# EAGLE board bontor_mbed_rev_c (EAGLE 6.3), part 1 of 2
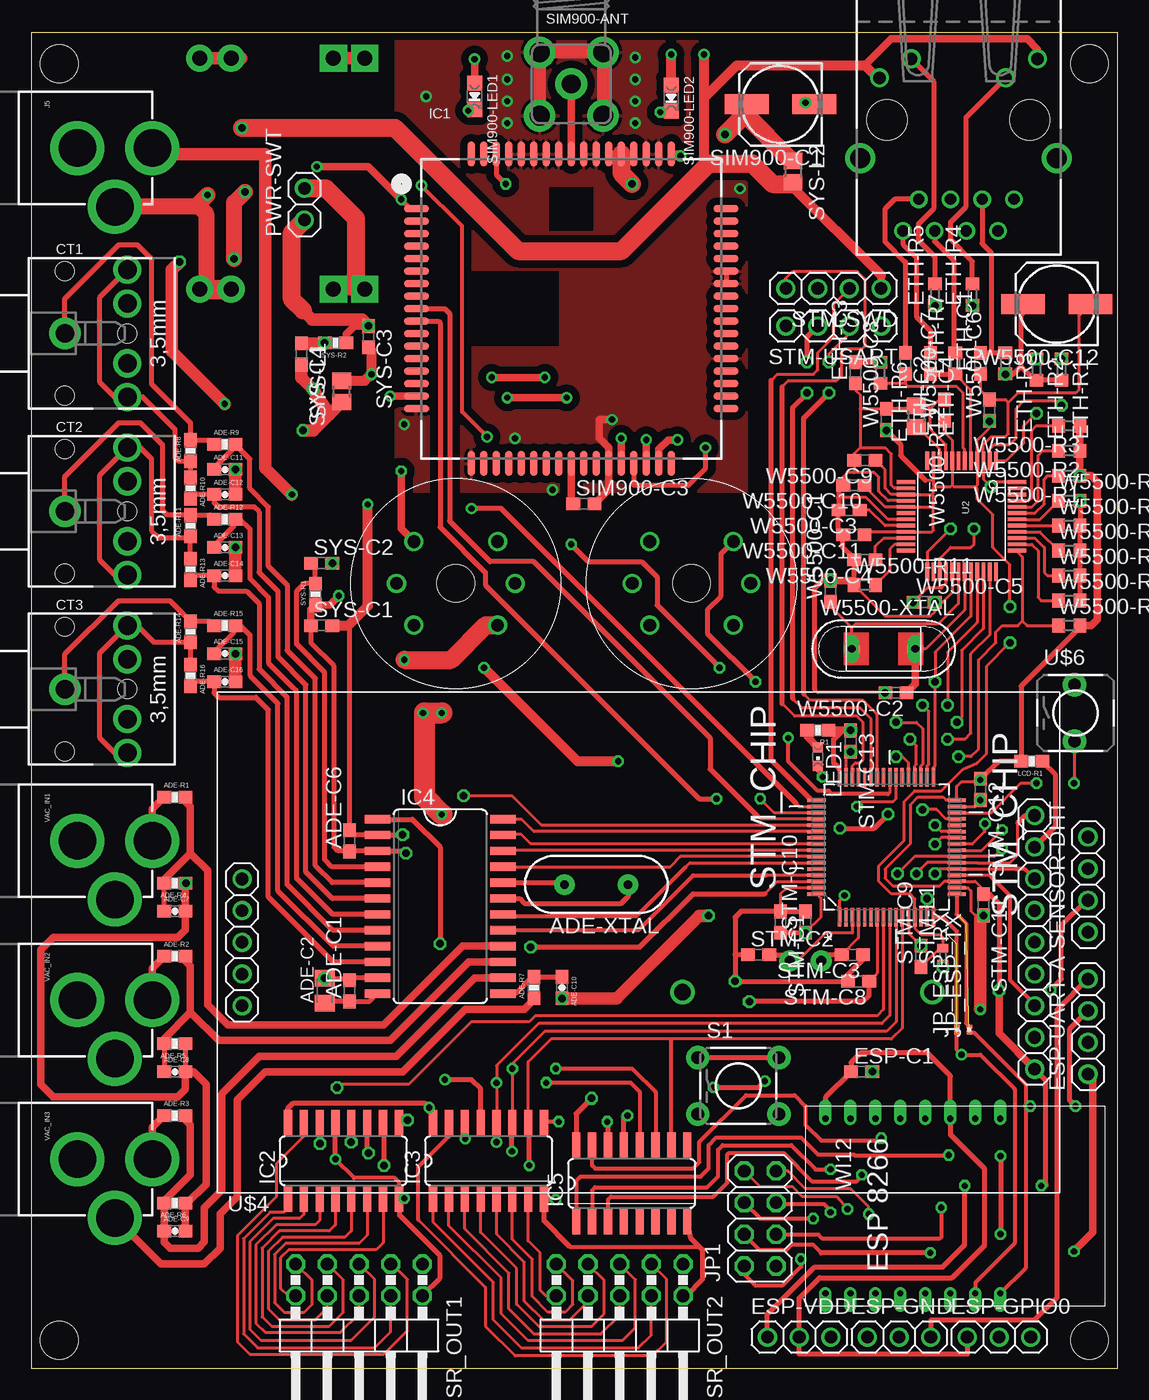
[diagram p2: board, top side]
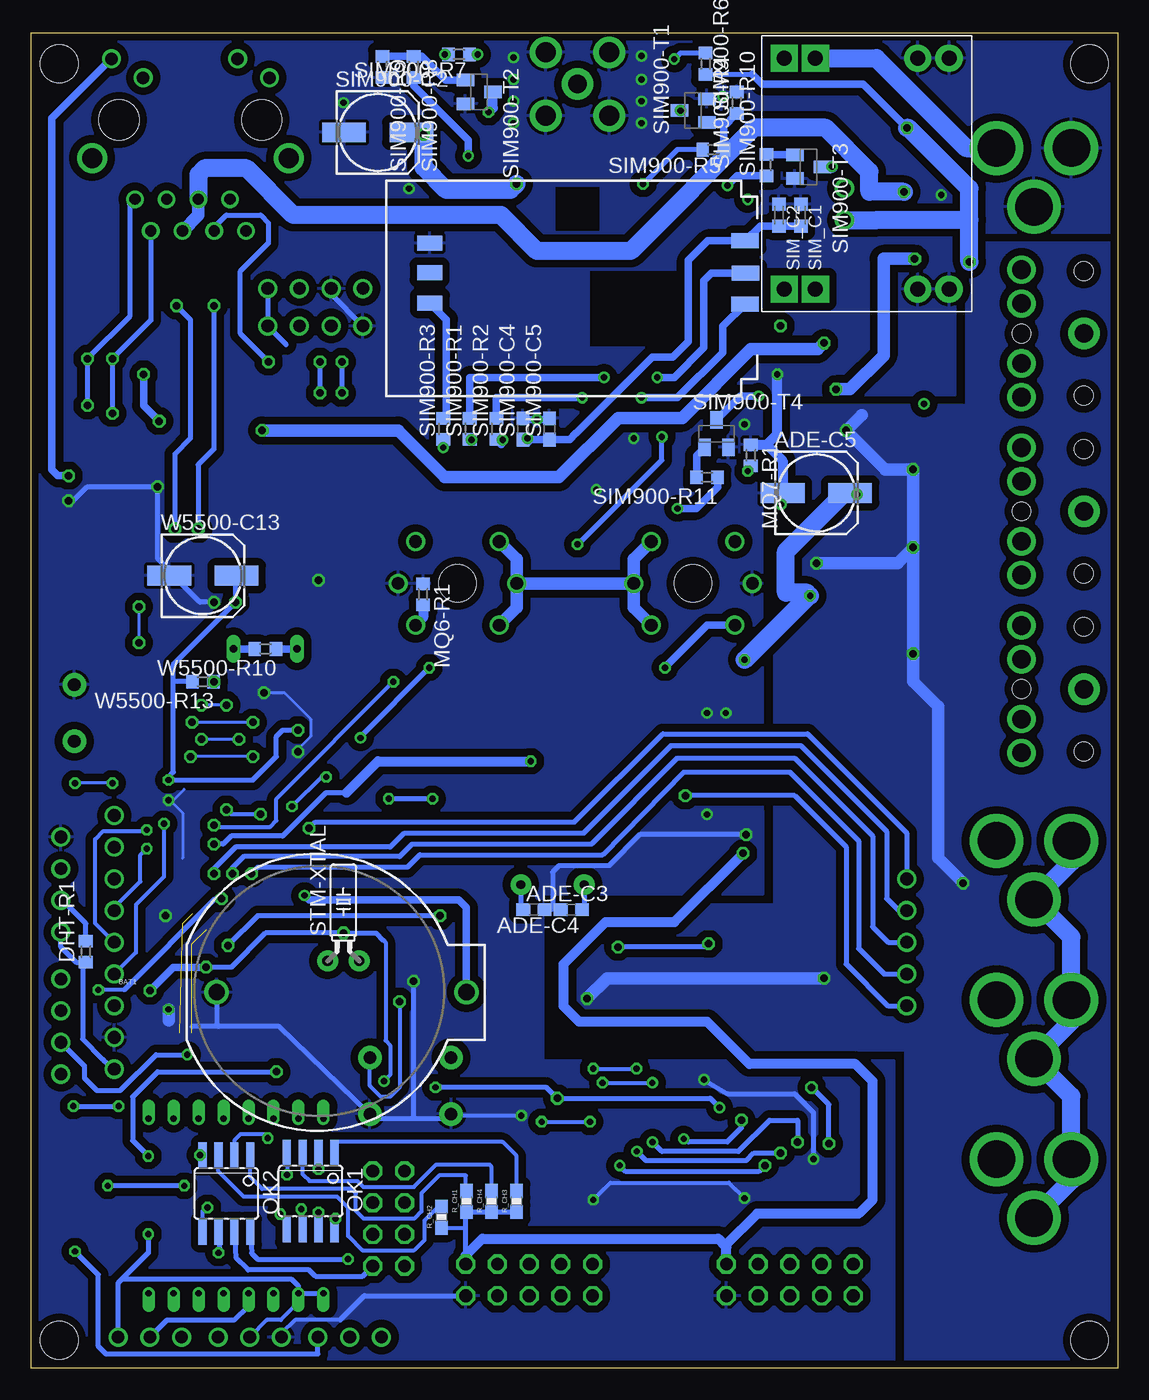
[diagram p3: board, bottom side, seen from below]

Size 87 x 107 mm. Coordinates in mm from the lower left corner, seen from the top.
Outline: 87,0 87,107 0,107 0,0 87,0
Copper layers (1*16): Top 0.035mm / dielectric 1.5mm / Bottom 0.035mm
Design rules "default *": minimum track width 10mil, minimum drill 10mil, track to track 0.125mm, track to pad 0.125mm, pad to pad 0.125mm, via to via 0.125mm, smd to smd 0mil, copper to edge 0.5mm, drill to drill 0.2mm, minimum pad ring 10mil, minimum via ring 8mil, stop-mask expansion 4mil, vias tented up to drill 0mil, thermal gap 10mil
Net classes: 1 power: width 0.305 mm, drill 0.6 mm, clearance 0.254 mm; 2 gnd: width 0.254 mm, drill 0.6 mm, clearance 0.254 mm
Holes 3 mm at 2.25,2.25 84.75,2.25 2.25,104.5 84.75,104.5

## Footprints (pad centres in the part's own frame; a part is rotated, then mirrored left to right if it is on the bottom)
C0603 = smd 1.1 x 1: 1 -0.85,0; 2 0.85,0
C0805K = smd 1.3 x 1.6: 1 -1,0; 2 1,0
153CLV-0605 = smd 3.5 x 1.6: + 2.7,0; - -2.7,0
0603-CAP = smd 1.1 x 1: 1 -0.85,0; 2 0.85,0
0603-RES = smd 1.1 x 1: 1 -0.85,0; 2 0.85,0
HC49US = drill 0.7 pad 1.651: 1 -2.54,0; 2 2.54,0
BATTCOM_20MM_PTH = drill 1.3: 1 11.85,0; 2 -8.15,0
STX3100 = drill 1.5 pad 2.54: 1 2.7,-0.1 | drill 1.5: 2 7.7,5; 3 7.7,2.3; 4 7.7,-2.5; 5 7.7,-5.2 | hole 1.5: 2.7,4.9; 2.7,-5.1; 7.7,-0.1
DCDCMODULE-SMALL = drill 1.2 pad 2.184: INM#1 1.8,15; INM#2 1.8,12.5; OUTM#1 20.3,15; OUTM#2 20.3,12.5 | drill 1.2 pad 2.184 square: INP#1 1.8,4.3; INP#2 1.8,1.8; OUTP#1 20.3,4.3; OUTP#2 20.3,1.8
R0603 = smd 1 x 1.1: 1 -0.85,0; 2 0.85,0
1X03 = drill 1.016: 1 -2.54,0; 2 0,0; 3 2.54,0
PINHD4 = drill 1.016: 1 -3.81,0; 2 -1.27,0; 3 1.27,0; 4 3.81,0
RJ45_PULSEJACK = drill 0.9: 1 4.445,-6.35; 2 3.175,-8.89; 3 1.905,-6.35; 4 0.635,-8.89; 5 -0.635,-6.35; 6 -1.905,-8.89; 7 -3.175,-6.35; 8 -4.445,-8.89 | drill 1: 9 6.325,4.9; 10 3.785,3.38; 11 -3.785,4.9; 12 -6.325,3.38 | drill 1.6: P$5 -7.875,-3.05; P$6 7.875,-3.05 | hole 3.2: -5.715,0; 5.715,0
SIM900_SMT = smd 2 x 0.6: P$1 -12.4,8; P$2 -12.4,7; P$3 -12.4,6; P$4 -12.4,5; P$5 -12.4,4; P$6 -12.4,3; P$7 -12.4,2; P$8 -12.4,1; P$9 -12.4,0; P$10 -12.4,-1; P$11 -12.4,-2; P$12 -12.4,-3; P$13 -12.4,-4; P$14 -12.4,-5; P$15 -12.4,-6; P$16 -12.4,-7; P$17 -12.4,-8; P$35 12.4,-8; P$36 12.4,-7; P$37 12.4,-6; P$38 12.4,-5; P$39 12.4,-4; P$40 12.4,-3; P$41 12.4,-2; P$42 12.4,-1; P$43 12.4,0; P$44 12.4,1; P$45 12.4,2; P$46 12.4,3; P$47 12.4,4; P$48 12.4,5; P$49 12.4,6; P$50 12.4,7; P$51 12.4,8 | smd 0.6 x 2: P$18 -8,-12.4; P$19 -7,-12.4; P$20 -6,-12.4; P$21 -5,-12.4; P$22 -4,-12.4; P$23 -3,-12.4; P$24 -2,-12.4; P$25 -1,-12.4; P$26 0,-12.4; P$27 1,-12.4; P$28 2,-12.4; P$29 3,-12.4; P$30 4,-12.4; P$31 5,-12.4; P$32 6,-12.4; P$33 7,-12.4; P$34 8,-12.4; P$52 8,12.4; P$53 7,12.4; P$54 6,12.4; P$55 5,12.4; P$56 4,12.4; P$57 3,12.4; P$58 2,12.4; P$59 1,12.4; P$60 0,12.4; P$61 -1,12.4; P$62 -2,12.4; P$63 -3,12.4; P$64 -4,12.4; P$65 -5,12.4; P$66 -6,12.4; P$67 -7,12.4; P$68 -8,12.4
SO16 = smd 0.66 x 2.032: 1 -4.445,-3.073; 2 -3.175,-3.073; 3 -1.905,-3.073; 4 -0.635,-3.073; 5 0.635,-3.073; 6 1.905,-3.073; 7 3.175,-3.073; 8 4.445,-3.073; 9 4.445,3.073; 10 3.175,3.073; 11 1.905,3.073; 12 0.635,3.073; 13 -0.635,3.073; 14 -1.905,3.073; 15 -3.175,3.073; 16 -4.445,3.073
SOIC24 = smd 0.66 x 2.032: 1 -6.985,-5.029; 2 -5.715,-5.029; 3 -4.445,-5.029; 4 -3.175,-5.029; 5 -1.905,-5.029; 6 -0.635,-5.029; 7 0.635,-5.029; 8 1.905,-5.029; 9 3.175,-5.029; 10 4.445,-5.029; 11 5.715,-5.029; 12 6.985,-5.029; 13 6.985,5.029; 14 5.715,5.029; 15 4.445,5.029; 16 3.175,5.029; 17 1.905,5.029; 18 0.635,5.029; 19 -0.635,5.029; 20 -1.905,5.029; 21 -3.175,5.029; 22 -4.445,5.029; 23 -5.715,5.029; 24 -6.985,5.029
POWER_JACK_PTH = drill 2.997 pad 4.318: GND 0,7.7; GNDBREAK 4.7,10.7; PWR 0,13.7
2X04 = drill 1.016 octagon: 1 -3.81,-1.27; 2 -3.81,1.27; 3 -1.27,-1.27; 4 -1.27,1.27; 5 1.27,-1.27; 6 1.27,1.27; 7 3.81,-1.27; 8 3.81,1.27
R0201 = smd 0.28 x 0.43: 1 -0.255,0; 2 0.255,0
CHIPLED_0603 = smd 0.8 x 0.8: A 0,-0.75; C 0,0.75
SOIC08 = smd 0.66 x 2.032: 1 -1.905,-3.073; 2 -0.635,-3.073; 3 0.635,-3.073; 4 1.905,-3.073; 5 1.905,3.073; 6 0.635,3.073; 7 -0.635,3.073; 8 -1.905,3.073
PINHD2 = drill 1.016: 1 -1.27,0; 2 1.27,0
TACTILE-PTH = drill 1.016 pad 1.88: 1 -3.251,2.261; 2 3.251,2.261; 3 -3.251,-2.261; 4 3.251,-2.261
MQ-3 = drill 1.016: A1 -3.35,3.35; A2 -3.35,-3.35; B1 3.35,3.35; B2 3.35,-3.35; HA -4.75,0; HB 4.75,0 | hole 3: 0,0
SMA90_DIP = drill 1.5 pad 2.54: ANTENNA 0,0 | drill 1.6 pad 2.54: GND1 -2.54,2.54; GND2 2.54,2.54; GND3 -2.54,-2.54; GND4 2.54,-2.54
CHIPLED_0805_NOOUTLINE = smd 1.2 x 1.2: A 0,-1.05; C 0,1.05
SOT23-BEC = smd 1 x 1.4: B -0.95,-1.1; C 0,1.1; E 0.95,-1.1
C0603K = smd 1.05 x 1.08: 1 -0.875,0; 2 0.875,0
SIMHOLDER3 = smd 2.2 x 1.2: 1 0.95,4.81; 2 0.91,7.41; 3 0.95,9.86 | smd 2 x 1.2: 4 26.2,9.78; 5 26.22,7.34; 6 26.22,4.98
2X05/90 = drill 1.016 octagon: 1 -5.08,-6.35; 2 -5.08,-3.81; 3 -2.54,-6.35; 4 -2.54,-3.81; 5 0,-6.35; 6 0,-3.81; 7 2.54,-6.35; 8 2.54,-3.81; 9 5.08,-6.35; 10 5.08,-3.81
0402 = smd 0.7 x 0.9: 1 -0.65,0; 2 0.65,0
TC26H = drill 0.813 pad 1.676: 1 -1.27,0; 2 1.27,0
QFP50P1200X1200X160-64N = smd 1.473 x 0.279: 1 -5.613,3.759; 2 -5.613,3.251; 3 -5.613,2.743; 4 -5.613,2.261; 5 -5.613,1.753; 6 -5.613,1.245; 7 -5.613,0.762; 8 -5.613,0.254; 9 -5.613,-0.254; 10 -5.613,-0.762; 11 -5.613,-1.245; 12 -5.613,-1.753; 13 -5.613,-2.261; 14 -5.613,-2.743; 15 -5.613,-3.251; 16 -5.613,-3.759; 33 5.613,-3.759; 34 5.613,-3.251; 35 5.613,-2.743; 36 5.613,-2.261; 37 5.613,-1.753; 38 5.613,-1.245; 39 5.613,-0.762; 40 5.613,-0.254; 41 5.613,0.254; 42 5.613,0.762; 43 5.613,1.245; 44 5.613,1.753; 45 5.613,2.261; 46 5.613,2.743; 47 5.613,3.251; 48 5.613,3.759 | smd 0.279 x 1.473: 17 -3.759,-5.613; 18 -3.251,-5.613; 19 -2.743,-5.613; 20 -2.261,-5.613; 21 -1.753,-5.613; 22 -1.245,-5.613; 23 -0.762,-5.613; 24 -0.254,-5.613; 25 0.254,-5.613; 26 0.762,-5.613; 27 1.245,-5.613; 28 1.753,-5.613; 29 2.261,-5.613; 30 2.743,-5.613; 31 3.251,-5.613; 32 3.759,-5.613; 49 3.759,5.613; 50 3.251,5.613; 51 2.743,5.613; 52 2.261,5.613; 53 1.753,5.613; 54 1.245,5.613; 55 0.762,5.613; 56 0.254,5.613; 57 -0.254,5.613; 58 -0.762,5.613; 59 -1.245,5.613; 60 -1.753,5.613; 61 -2.261,5.613; 62 -2.743,5.613; 63 -3.251,5.613; 64 -3.759,5.613
FB805 = smd 1.3 x 1.5: 1 -0.85,0; 2 0.85,0
W5500 = smd 1.5 x 0.3: 1 -4.45,2.75; 2 -4.45,2.25; 3 -4.45,1.75; 4 -4.45,1.25; 5 -4.45,0.75; 6 -4.45,0.25; 7 -4.45,-0.25; 8 -4.45,-0.75; 9 -4.45,-1.25; 10 -4.45,-1.75; 11 -4.45,-2.25; 12 -4.45,-2.75; 25 4.45,-2.75; 26 4.45,-2.25; 27 4.45,-1.75; 28 4.45,-1.25; 29 4.45,-0.75; 30 4.45,-0.25; 31 4.45,0.25; 32 4.45,0.75; 33 4.45,1.25; 34 4.45,1.75; 35 4.45,2.25; 36 4.45,2.75 | smd 0.3 x 1.5: 13 -2.75,-4.45; 14 -2.25,-4.45; 15 -1.75,-4.45; 16 -1.25,-4.45; 17 -0.75,-4.45; 18 -0.25,-4.45; 19 0.25,-4.45; 20 0.75,-4.45; 21 1.25,-4.45; 22 1.75,-4.45; 23 2.25,-4.45; 24 2.75,-4.45; 37 2.75,4.45; 38 2.25,4.45; 39 1.75,4.45; 40 1.25,4.45; 41 0.75,4.45; 42 0.25,4.45; 43 -0.25,4.45; 44 -0.75,4.45; 45 -1.25,4.45; 46 -1.75,4.45; 47 -2.25,4.45; 48 -2.75,4.45
CRISTAL-ABM7 = smd 1.27 x 0.635: P$1 -2.54,0; P$2 2.54,0
TFT_LCD_2.2+F_CS = drill 1.016: F_CS -31.86,5.08; LCD_CS 31.6,-5.08; LCD_D/C 31.6,0; LCD_GND 31.6,-7.62; LCD_LED 31.6,7.62; LCD_MISO 31.6,10.16; LCD_MOSI 31.6,2.54; LCD_RESET 31.6,-2.54; LCD_SCK 31.6,5.08; LCD_VCC 31.6,-10.16; SD_CS -31.86,-5.08; SD_MISO -31.86,0; SD_MOSI -31.86,-2.54; SD_SCK -31.86,2.54
WI12 = drill 0.5 pad 0.813 offset: ADC 10.4,1; CH_PD 12.4,1; GND 22.4,15; GPIO00 16.4,15; GPIO02 18.4,15; GPIO04 12.4,15; GPIO05 14.4,15; GPIO12 18.4,1; GPIO13 20.4,1; GPIO14 16.4,1; GPIO15 20.4,15; GPIO16 14.4,1; REST 8.4,1; RXD 10.4,15; TXD 8.4,15; VCC 22.4,1
TACTILE-PTH-SINGLE = drill 1.016 pad 1.88: 1 -0.076,2.261; 3 -0.076,-2.261
R0805 = smd 1.3 x 1.5: 1 -0.85,0; 2 0.85,0
QS = drill 0.61 long: 1 -2.54,0; 2 2.54,0

## Placement (x,y rotation side)
ADE-C1  0.1uF  [C0603]  25.5,30.25 90 top
ADE-C2  10uF  [C0805K]  23.5,30.25 90 top
ADE-C3  22pF  [C0603]  46.75,36.75 0 bottom
ADE-C4  22pF  [C0603]  43.75,36.75 180 bottom
ADE-C5  10uF  [153CLV-0605]  24.12,70.12 0 bottom
ADE-C6  100nF  [C0603]  25.5,42.25 90 top
ADE-C7  33nF  [0603-CAP]  11.5,36.62 0 top
ADE-C8  33nF  [0603-CAP]  11.5,23.75 0 top
ADE-C9  33nF  [0603-CAP]  11.5,11 0 top
ADE-C10  33nF  [0603-CAP]  42.5,30.5 270 top
ADE-C11  33nF  [0603-CAP]  15.5,72 0 top
ADE-C12  33nF  [0603-CAP]  15.5,70 0 top
ADE-C13  33nF  [0603-CAP]  15.5,65.75 0 top
ADE-C14  33nF  [0603-CAP]  15.5,63.5 0 top
ADE-C15  33nF  [0603-CAP]  15.5,57.25 0 top
ADE-C16  33nF  [0603-CAP]  15.5,55 0 top
ADE-R1  81K  [0603-RES]  11.5,45.75 0 top
ADE-R2  81K  [0603-RES]  11.5,33 0 top
ADE-R3  81K  [0603-RES]  11.5,20.25 0 top
ADE-R4  1K  [0603-RES]  11.5,38.88 180 top
ADE-R5  1K  [0603-RES]  11.5,26 180 top
ADE-R6  1K  [0603-RES]  11.5,13.25 180 top
ADE-R7  1K  [0603-RES]  40.25,30.5 90 top
ADE-R8  33R  [0603-RES]  12.75,73.5 90 top
ADE-R9  1K  [0603-RES]  15.5,74 0 top
ADE-R10  1K  [0603-RES]  12.75,70.5 270 top
ADE-R11  33R  [0603-RES]  12.75,67.5 90 top
ADE-R12  1K  [0603-RES]  15.5,68 0 top
ADE-R13  1K  [0603-RES]  12.75,64 270 top
ADE-R14  33R  [0603-RES]  12.75,59 90 top
ADE-R15  1K  [0603-RES]  15.5,59.5 0 top
ADE-R16  1K  [0603-RES]  12.75,55.5 270 top
ADE-XTAL  10MHz  [HC49US]  45.25,38.75 180 top
BAT1  [BATTCOM_20MM_PTH]  64,30.12 0 bottom
CT1  100A  [STX3100]  0,83 0 top
CT2  100A  [STX3100]  0,68.75 0 top
CT3  100A  [STX3100]  0,54.5 0 top
DCDC-3.5V  DCDCMODULE_SMALL  [DCDCMODULE-SMALL]  28.5,106.75 270 bottom
DHT-R1  10k  [R0603]  82.62,33.38 90 bottom
ESP-C1  100nF  [C0603]  66.5,23.75 0 top
ESP-GND  [1X03]  69.5,2.5 0 top
ESP-GPIO0  [1X03]  77.5,2.5 0 top
ESP-UART-A  PINHD4  [PINHD4]  84.62,27.38 90 top
ESP-VDD  [1X03]  61.5,2.5 0 top
ETH-C1  22nF  [C0603]  76,80.5 90 top
ETH-C2  6.8nF  [C0603]  70,80.5 270 top
ETH-C3  10nF  [C0603]  66,79.75 90 top
ETH-C4  6.8nF  [C0603]  72,80.5 270 top
ETH-R1  49R9  [R0603]  82.5,80 270 top
ETH-R2  49R9  [R0603]  80.5,80 270 top
ETH-R3  10R  [R0603]  78,80.5 270 top
ETH-R4  330  [R0603]  75.38,86 90 top
ETH-R5  330  [R0603]  72.38,86 90 top
ETH-R6  49R9  [R0603]  68,79.75 270 top
ETH-R7  49R9  [R0603]  74,80.5 90 top
ETHERNET  [RJ45_PULSEJACK]  74.25,100 0 top
IC1  SIM900  [SIM900_SMT]  43.25,84.88 0 top
IC2  74HC595D  [SO16]  25,16.62 0 top
IC3  74HC595D  [SO16]  36.62,16.62 0 top
IC4  ADE7758RW  [SOIC24]  32.75,37 270 top
IC5  74HC595D  [SO16]  48.09,14.81 0 top
J5  POWER_JACKPTH  [POWER_JACK_PTH]  -4,97.75 270 top
JP1  [2X04]  58.38,12 90 top
JP_ESP_RX  0  [R0201]  74.12,27.12 90 top
JP_ESP_TX  0  [R0201]  75.12,27.12 90 top
LCD-R1  680R  [0603-RES]  80.12,48.62 180 top
LED1  [CHIPLED_0603]  63,49 180 top
MQ6-R1  10k  [R0603]  55.62,62 270 bottom
MQ7-R1  10k  [R0603]  29.38,73.12 270 bottom
OK1  ILD205  [SOIC08]  64.62,14.2 180 bottom
OK2  ILD205  [SOIC08]  71.38,14 180 bottom
PWR-SWT  PINHD2  [PINHD2]  21.88,93.25 90 top
R1  [0603-RES]  63,51.12 180 top
R_CH1  270  [0603-RES]  52.12,13.38 90 bottom
R_CH2  270  [0603-RES]  54.14,12.11 90 bottom
R_CH3  270  [0603-RES]  48.12,13.38 90 bottom
R_CH4  270  [0603-RES]  50.12,13.38 90 bottom
S1  [TACTILE-PTH]  56.62,22.62 0 top
SENSOR-DHT  PINHD4  [PINHD4]  84.62,38.75 90 top
SENSOR-MQ6  METHANE_SENSOR  [MQ-3]  52.88,62.88 0 top
SENSOR-MQ7  METHANE_SENSOR  [MQ-3]  34,62.88 180 top
SIM900-ANT  [SMA90_DIP]  43.25,102.88 0 top
SIM900-C1  100uF  [153CLV-0605]  60,101.25 180 top
SIM900-C2  100uF  [153CLV-0605]  59.25,99 0 bottom
SIM900-C3  4u7  [C0603]  44.25,69.25 0 top
SIM900-C4  100nF  [C0603]  47.62,75.25 90 bottom
SIM900-C5  22pF  [C0603]  45.5,75.25 90 bottom
SIM900-LED1  [CHIPLED_0805_NOOUTLINE]  35.5,101.88 180 top
SIM900-LED2  [CHIPLED_0805_NOOUTLINE]  51.25,101.75 180 top
SIM900-R1  22R  [R0603]  51.88,75.25 90 bottom
SIM900-R2  22R  [R0603]  49.75,75.25 90 bottom
SIM900-R3  22R  [R0603]  54,75.25 90 bottom
SIM900-R4  680R  [R0603]  33,104.5 270 bottom
SIM900-R5  1K  [R0603]  32.38,97.62 180 bottom
SIM900-R6  10K  [R0603]  30.5,101.38 90 bottom
SIM900-R7  680R  [R0603]  52.75,105.25 180 bottom
SIM900-R8  1K  [R0603]  56.38,104.25 270 bottom
SIM900-R9  10K  [R0603]  58.88,104.25 270 bottom
SIM900-R10  120R  [R0603]  28.12,96.38 90 bottom
SIM900-R11  120R  [R0603]  32.88,71.38 180 bottom
SIM900-T1  [SOT23-BEC]  34,100.75 90 bottom
SIM900-T2  [SOT23-BEC]  51.12,102.25 270 bottom
SIM900-T3  [SOT23-BEC]  24.75,96.25 270 bottom
SIM900-T4  [SOT23-BEC]  32.12,74.88 0 bottom
SIM_C1  100nF  [C0603K]  25.38,92.38 270 bottom
SIM_C2  22pF  [C0603K]  27.12,92.38 270 bottom
SIM_HOLDER  SIMHOLDER3  [SIMHOLDER3]  28.88,95.12 180 bottom
SR_OUT1  [2X05/90]  26.25,2 180 top
SR_OUT2  [2X05/90]  47.12,2 180 top
STM-C1  1uF  [C0603]  60,35.75 270 top
STM-C2  4.3pF  [C0603]  58.25,33.12 0 top
STM-C3  4.3pF  [C0603]  65.75,33.12 180 top
STM-C8  100nF  [C0603]  66.25,31 180 top
STM-C9  100nF  [C0603]  71.25,33 90 top
STM-C10  100nF  [C0603]  62,35.75 90 top
STM-C11  100nF  [C0603]  76.25,37.12 270 top
STM-C12  100nF  [C0603]  76,46.38 270 top
STM-C13  100nF  [C0603]  65.62,50.25 270 top
STM-L1  BLM15HB121SN1  [0402]  73,33 90 top
STM-SWD  PINHD4  [PINHD4]  64.25,86.5 180 top
STM-USART  PINHD4  [PINHD4]  64.25,83.5 180 top
STM-XTAL  32.768kHz  [TC26H]  62,32.62 0 bottom
STM_CHIP  STM32F103RBT6  [QFP50P1200X1200X160-64N]  68.5,41.75 90 top
SYS-C1  0.1uF  [C0603]  23.25,59.5 0 top
SYS-C2  0.1uF  [C0603]  23.25,64.5 0 top
SYS-C3  0.1uF  [C0603]  27,82.62 270 top
SYS-C4  0.1uF  [C0603]  21.62,81.25 270 top
SYS-L1  150Mhz  [FB805]  24.88,78.25 90 top
SYS-L2  150Mhz  [FB805]  61,95.88 270 top
SYS-R1  10R  [0603-RES]  22.75,62 90 top
SYS-R2  10R  [0603-RES]  24.38,82.12 180 top
U2  W5500  [W5500]  74.5,68.25 270 top
U$3  CRISTAL-ABM7  [CRISTAL-ABM7]  68.25,57.62 0 top
U$4  TFT_LCD_2.2+F_CS  [TFT_LCD_2.2+F_CS]  48.75,34.12 0 top
U$5  ESP8266WI12  [WI12]  86,21 180 top
U$6  TAC_SWITCH_SINGLE  [TACTILE-PTH-SINGLE]  83.62,52.5 0 top
VAC_IN1  9V  [POWER_JACK_PTH]  -4,42.25 270 top
VAC_IN2  9V  [POWER_JACK_PTH]  -4,29.5 270 top
VAC_IN3  9V  [POWER_JACK_PTH]  -4,16.75 270 top
W5500-C1  18pF  [C0603]  64,62.25 90 top
W5500-C2  18pF  [C0603]  69.25,54.12 180 top
W5500-C3  4.7uF  [C0603]  65.5,68.75 180 top
W5500-C4  10nF  [C0603]  66.75,64.75 180 top
W5500-C5  100nF  [C0603]  71.5,61.38 0 top
W5500-C6  100nF  [C0603]  76.75,76.75 90 top
W5500-C7  100nF  [C0603]  73.12,76.75 90 top
W5500-C8  100nF  [C0603]  68.5,76 90 top
W5500-C9  100nF  [C0603]  66.75,72.75 180 top
W5500-C10  100nF  [C0603]  65.88,70.75 180 top
W5500-C11  100nF  [C0603]  65.88,66.75 180 top
W5500-C12  10uF/16V  [153CLV-0605]  82.12,85.25 180 top
W5500-C13  10uF/16V  [153CLV-0605]  73.25,63.5 0 bottom
W5500-R1  10k  [R0603]  83.12,71.5 180 top
W5500-R2  10k  [R0603]  83.12,73.5 180 top
W5500-R3  10k  [R0603]  83.12,75.5 180 top
W5500-R4  10k  [R0603]  83.12,69.5 0 top
W5500-R5  10k  [R0603]  83.12,67.5 0 top
W5500-R6  10k  [R0603]  83.12,65.5 0 top
W5500-R7  10k  [R0603]  83.12,63.5 0 top
W5500-R8  10k  [R0603]  83.12,61.5 0 top
W5500-R9  10k  [R0603]  83.12,59.5 0 top
W5500-R10  1M  [R0603]  68.25,57.62 180 bottom
W5500-R11  10k  [R0603]  66.75,62.75 0 top
W5500-R12  12K4  [R0805]  70.88,76.25 270 top
W5500-R13  10k  [R0603]  73.25,55 180 bottom
W5500-XTAL  25MHz  [QS]  68.25,57.62 0 top